# Altium schematic sheet bio_dnt_adc_filter.SchDoc: Имя
size 209 x 297 mm; ApprovedBy: Утвердил; CheckedBy: Проверил; Author: Разработал; Organization: НГУ; DocumentNumber: ЮМП.445.020.51 Э3; SheetNumber: 3; SheetTotal: Листов; PageSetup: Record=PageOptions|CenterHorizontal=True|CenterVertical=True|PrintScale=1.00|XCorrection=1.00|YCorrection=1.00|PrintKind=1|BorderSize=5000000|LeftOffset=0|BottomOffset=0|Orientation=2|PaperLength=1000|PaperWidth=1000|Scale=100|PaperSource=15|PrintQuality=1200|MediaType=1|DitherType=10|PaperKind=A3|PrintScaleMode=1; Weight: -; ScaleFactor: -; NormInspection: Норм.Контр.
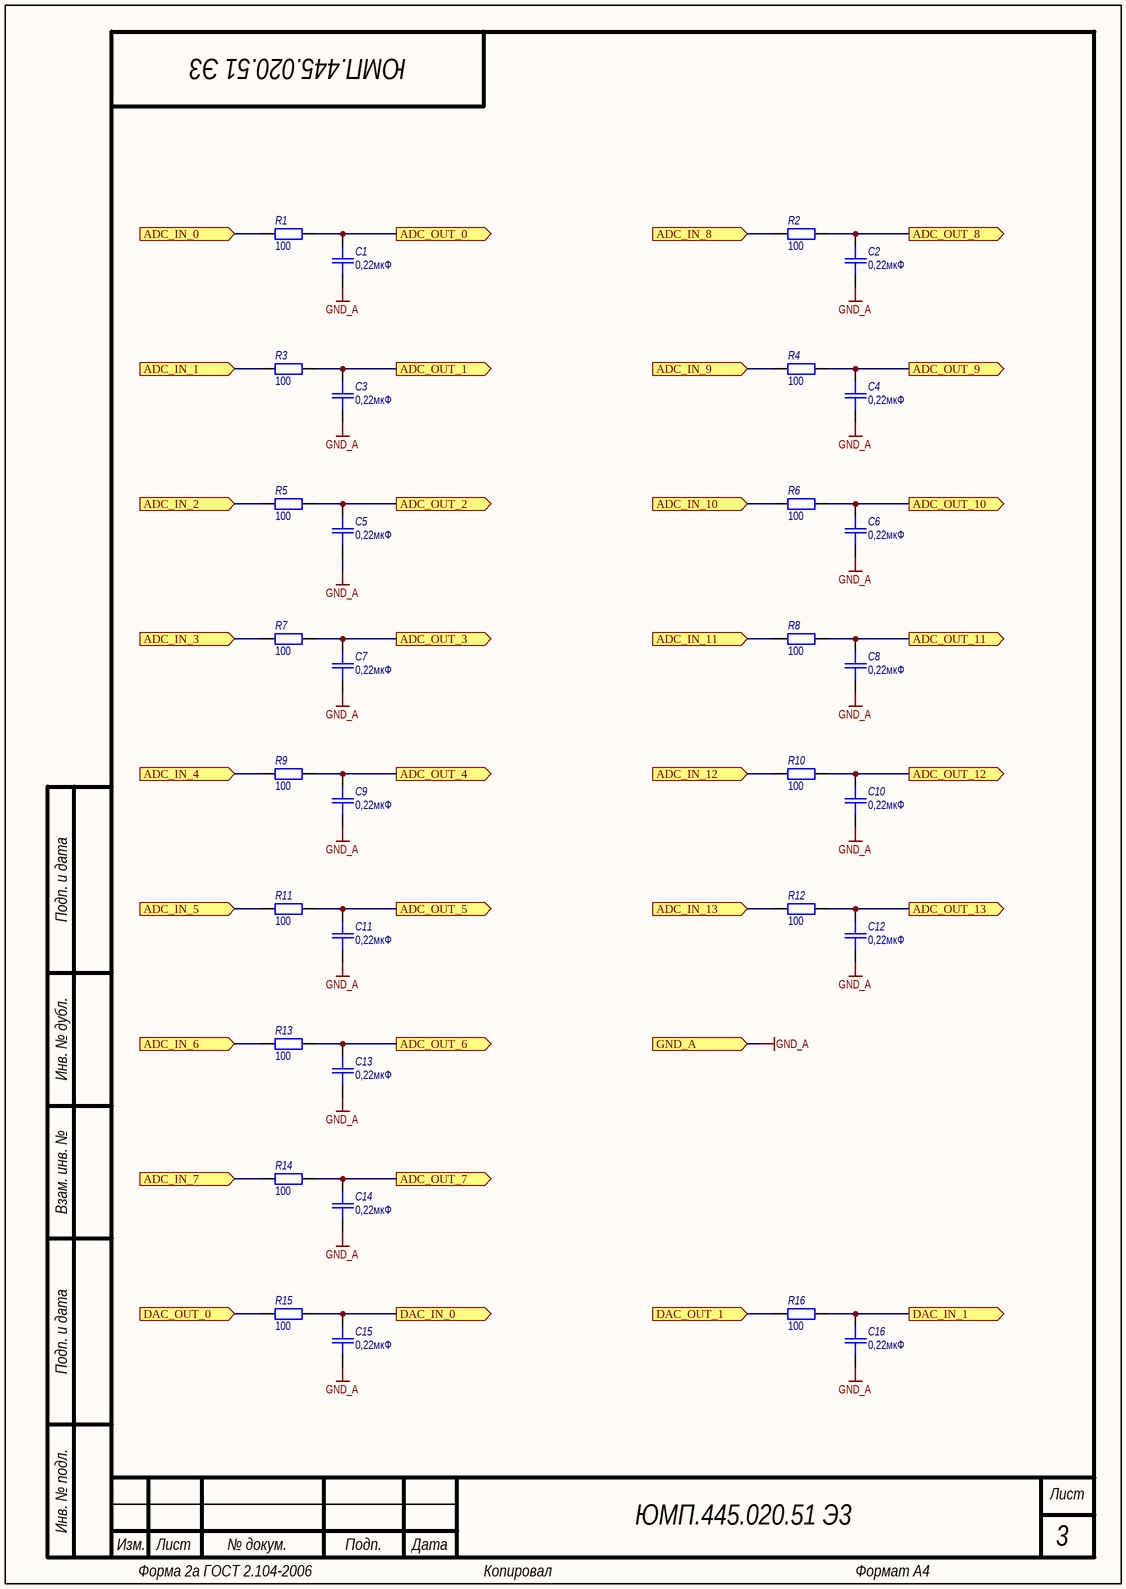
[diagram p0: bio_dnt_adc_filter.SchDoc]

## Parts
C1  0,22мкФ  [CR-0805]
C2  0,22мкФ  [CR-0805]
C3  0,22мкФ  [CR-0805]
C4  0,22мкФ  [CR-0805]
C5  0,22мкФ  [CR-0805]
C6  0,22мкФ  [CR-0805]
C7  0,22мкФ  [CR-0805]
C8  0,22мкФ  [CR-0805]
C9  0,22мкФ  [CR-0805]
C10  0,22мкФ  [CR-0805]
C11  0,22мкФ  [CR-0805]
C12  0,22мкФ  [CR-0805]
C13  0,22мкФ  [CR-0805]
C14  0,22мкФ  [CR-0805]
C15  0,22мкФ  [CR-0805]
C16  0,22мкФ  [CR-0805]
R1  100  [CR-0805]
R2  100  [CR-0805]
R3  100  [CR-0805]
R4  100  [CR-0805]
R5  100  [CR-0805]
R6  100  [CR-0805]
R7  100  [CR-0805]
R8  100  [CR-0805]
R9  100  [CR-0805]
R10  100  [CR-0805]
R11  100  [CR-0805]
R12  100  [CR-0805]
R13  100  [CR-0805]
R14  100  [CR-0805]
R15  100  [CR-0805]
R16  100  [CR-0805]

## Ports
ADC_IN_0 (in), ADC_IN_1 (in), ADC_IN_2 (in), ADC_IN_3 (in), ADC_IN_4 (in), ADC_IN_5 (in), ADC_IN_6 (in), ADC_IN_7 (in), ADC_IN_8 (in), ADC_IN_9 (in), ADC_IN_10 (in), ADC_IN_11 (in), ADC_IN_12 (in), ADC_IN_13 (in), ADC_OUT_0 (out), ADC_OUT_1 (out), ADC_OUT_2 (out), ADC_OUT_3 (out), ADC_OUT_4 (out), ADC_OUT_5 (out), ADC_OUT_6 (out), ADC_OUT_7 (out), ADC_OUT_8 (out), ADC_OUT_9 (out), ADC_OUT_10 (out), ADC_OUT_11 (out), ADC_OUT_12 (out), ADC_OUT_13 (out), DAC_IN_0 (out), DAC_IN_1 (out), DAC_OUT_0 (in), DAC_OUT_1 (in), GND_A (in)

## Nets
GND_A: C1.1 C2.1 C3.1 C4.1 C5.1 C6.1 C7.1 C8.1 C9.1 C10.1 C11.1 C12.1 C13.1 C14.1 C15.1 C16.1 ; port GND_A
ADC_IN_0: R1.2 ; port ADC_IN_0
ADC_IN_1: R3.2 ; port ADC_IN_1
ADC_IN_2: R5.2 ; port ADC_IN_2
ADC_IN_3: R7.2 ; port ADC_IN_3
ADC_IN_4: R9.2 ; port ADC_IN_4
ADC_IN_5: R11.2 ; port ADC_IN_5
ADC_IN_6: R13.2 ; port ADC_IN_6
ADC_IN_7: R14.2 ; port ADC_IN_7
ADC_IN_8: R2.2 ; port ADC_IN_8
ADC_IN_9: R4.2 ; port ADC_IN_9
ADC_IN_10: R6.2 ; port ADC_IN_10
ADC_IN_11: R8.2 ; port ADC_IN_11
ADC_IN_12: R10.2 ; port ADC_IN_12
ADC_IN_13: R12.2 ; port ADC_IN_13
ADC_OUT_0: C1.2 R1.1 ; port ADC_OUT_0
ADC_OUT_1: C3.2 R3.1 ; port ADC_OUT_1
ADC_OUT_2: C5.2 R5.1 ; port ADC_OUT_2
ADC_OUT_3: C7.2 R7.1 ; port ADC_OUT_3
ADC_OUT_4: C9.2 R9.1 ; port ADC_OUT_4
ADC_OUT_5: C11.2 R11.1 ; port ADC_OUT_5
ADC_OUT_6: C13.2 R13.1 ; port ADC_OUT_6
ADC_OUT_7: C14.2 R14.1 ; port ADC_OUT_7
ADC_OUT_8: C2.2 R2.1 ; port ADC_OUT_8
ADC_OUT_9: C4.2 R4.1 ; port ADC_OUT_9
ADC_OUT_10: C6.2 R6.1 ; port ADC_OUT_10
ADC_OUT_11: C8.2 R8.1 ; port ADC_OUT_11
ADC_OUT_12: C10.2 R10.1 ; port ADC_OUT_12
ADC_OUT_13: C12.2 R12.1 ; port ADC_OUT_13
DAC_IN_0: C15.2 R15.1 ; port DAC_IN_0
DAC_IN_1: C16.2 R16.1 ; port DAC_IN_1
DAC_OUT_0: R15.2 ; port DAC_OUT_0
DAC_OUT_1: R16.2 ; port DAC_OUT_1

## Notes on the sheet
- Подп. и дата
- Инв. № дубл.
- Взам. инв. №
- Инв. № подл.
- Изм.
- Лист
- № докум.
- Подп.
- Дата
- Форма 2а ГОСТ 2.104-2006
- Копировал
- Формат А4

## Library data of the parts
C1-C16 = C_smd: Конденсатор для поверхностного монтажа; Назначение: Чип-конденсатор; Наименование: К10-79 МП0 «ВП»; Потребление, Вт: 0; Value: 0,22мкФ
R1-R16 = R_smd: Резистор для поверхностного монтажа; Наименование: Р1-12-0.125 ОСМ; Назначение: Чип-резистор; Потребление, Вт: 0,001; Value: 100